# Altium schematic sheet frontend.SchDoc
size 297 x 209 mm
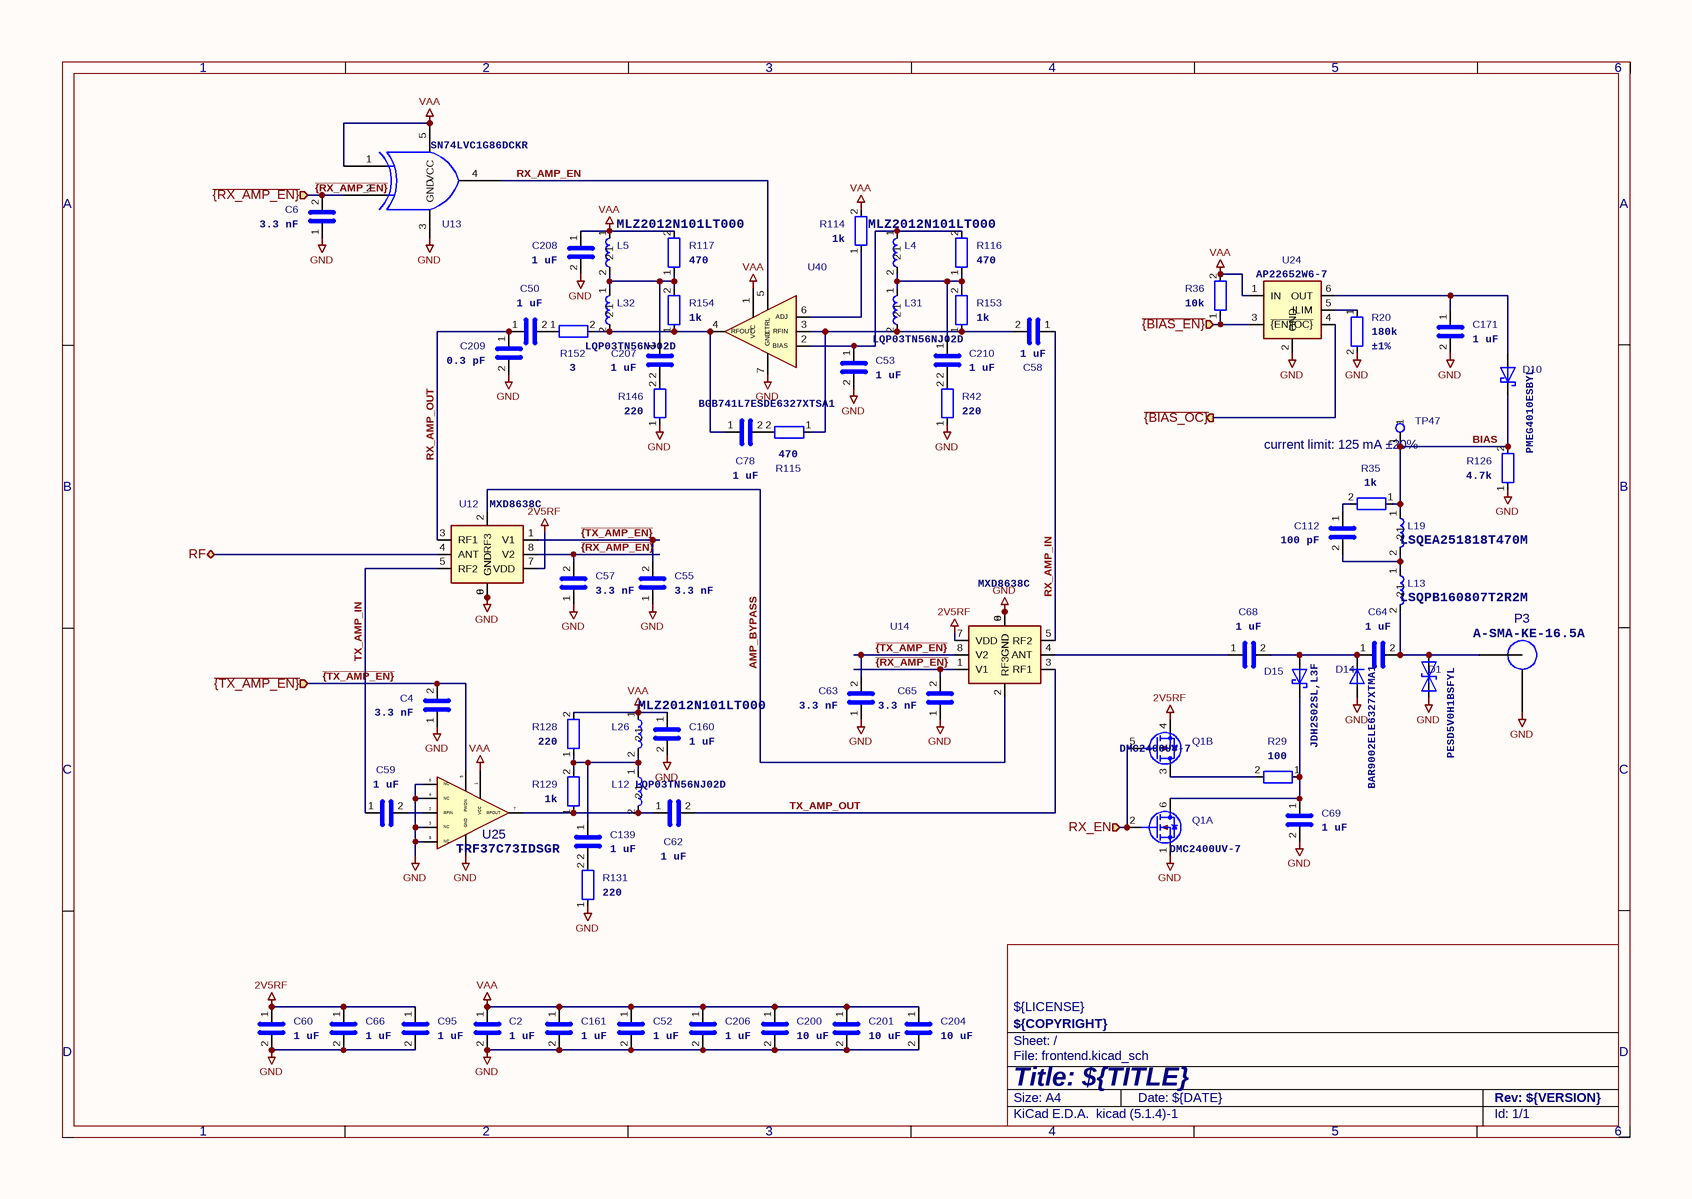
[diagram p0: frontend.SchDoc]

## Parts
C2  1 uF  [C_0201_0603Metric]
C4  3.3 nF  [C_0201_0603Metric]
C6  3.3 nF  [C_0201_0603Metric]
C50  1 uF  [C_0201_0603Metric]
C52  1 uF  [C_0201_0603Metric]
C53  1 uF  [C_0201_0603Metric]
C55  3.3 nF  [C_0201_0603Metric]
C57  3.3 nF  [C_0201_0603Metric]
C58  1 uF  [C_0201_0603Metric]
C59  1 uF  [C_0201_0603Metric]
C60  1 uF  [C_0201_0603Metric]
C62  1 uF  [C_0201_0603Metric]
C63  3.3 nF  [C_0201_0603Metric]
C64  1 uF  [C_0402_1005Metric]
C65  3.3 nF  [C_0201_0603Metric]
C66  1 uF  [C_0201_0603Metric]
C68  1 uF  [C_0201_0603Metric]
C69  1 uF  [C_0201_0603Metric]
C78  1 uF  [C_0201_0603Metric]
C95  1 uF  [C_0201_0603Metric]
C112  100 pF  [C_0201_0603Metric]
C139  1 uF  [C_0201_0603Metric]
C160  1 uF  [C_0201_0603Metric]
C161  1 uF  [C_0201_0603Metric]
C171  1 uF  [C_0402_1005Metric]
C200  10 uF  [C_0805_2012Metric]
C201  10 uF  [C_0805_2012Metric]
C204  10 uF  [C_0805_2012Metric]
C206  1 uF  [C_0201_0603Metric]
C207  1 uF  [C_0201_0603Metric]
C208  1 uF  [C_0201_0603Metric]
C209  0.3 pF  [C_0201_0603Metric]
C210  1 uF  [C_0201_0603Metric]
D1  Part Number: PESD5V0H1BSFYL  [TSSLP-2-1]  (hidden comment: TVS)
D10  Part Number: PMEG4010ESBYL  [TSLP-2-19]  (hidden comment: Schottky)
D14  Part Number: BAR9002ELE6327XTMA1  [TSLP-2-19]  (hidden comment: PIN)
D15  Part Number: JDH2S02SL,L3F  [TSSLP-2-1]  (hidden comment: Schottky)
L4  Part Number: MLZ2012N101LT000  [L_TDK_MLZ2012_h1.25mm]  (hidden comment: 100 uH)
L5  Part Number: MLZ2012N101LT000  [L_TDK_MLZ2012_h1.25mm]  (hidden comment: 100 uH)
L12  Part Number: LQP03TN56NJ02D  [L_0201_0603Metric]  (hidden comment: 56 nH)
L13  Part Number: LSQPB160807T2R2M  [L_0603_1608Metric]  (hidden comment: 2.2 uH)
L19  Part Number: LSQEA251818T470M  [L_Taiyo-Yuden_A251818]  (hidden comment: 47 uH)
L26  Part Number: MLZ2012N101LT000  [L_TDK_MLZ2012_h1.25mm]  (hidden comment: 100 uH)
L31  Part Number: LQP03TN56NJ02D  [L_0201_0603Metric]  (hidden comment: 56 nH)
L32  Part Number: LQP03TN56NJ02D  [L_0201_0603Metric]  (hidden comment: 56 nH)
P3  Part Number: A-SMA-KE-16.5A  [SMA_MyAntenna_A-SMA-KE-16.5A_EdgeMount]  (hidden comment: SMA)
Q1  Part Number: DMC2400UV-7  [SOT-563]  (hidden comment: NMOS/PMOS)  (parts A,B of 2)
R20  Tolerance: ±1%  [R_0402_1005Metric]  (hidden comment: 180k)
R29  100  [R_0201_0603Metric]
R35  1k  [R_0201_0603Metric]
R36  10k  [R_0402_1005Metric]
R42  220  [R_0201_0603Metric]
R114  1k  [R_0201_0603Metric]
R115  470  [R_0201_0603Metric]
R116  470  [R_0201_0603Metric]
R117  470  [R_0201_0603Metric]
R126  4.7k  [R_0201_0603Metric]
R128  220  [R_0201_0603Metric]
R129  1k  [R_0201_0603Metric]
R131  220  [R_0201_0603Metric]
R146  220  [R_0201_0603Metric]
R152  3  [R_0201_0603Metric]
R153  1k  [R_0201_0603Metric]
R154  1k  [R_0201_0603Metric]
TP47  TestPoint  [TestPoint_Pad_D1.0mm]  (value not drawn)
U12  MXD8638C  [MXD8638C]
U13  Part Number: SN74LVC1G86DCKR  [SOT-353_SC-70-5]  (hidden comment: 74LVC1G86)
U14  MXD8638C  [MXD8638C]
U24  Part Number: AP22652W6-7  [TSOP-6_1.65x3.05mm_P0.95mm]  (hidden comment: AP22652)
U25  Part Number: TRF37C73IDSGR  [WSON-8-1EP_2x2mm_P0.5mm_EP0.9x1.6mm]  (hidden comment: TRF37C73)
U40  Part Number: BGB741L7ESDE6327XTSA1  [TSLP-7-1]  (hidden comment: BGB741L7ESD)

## Ports
RF (bidir), RX_EN (in), ~{{BIAS_EN}} (in), ~{{BIAS_OC}} (out), ~{{RX_AMP_EN}} (in), ~{{TX_AMP_EN}} (in)

## Nets
2V5RF: C60.1 C66.1 C95.1 Q1.4(S) U12.7(VDD) U14.7(VDD)
GND: C2.2 C4.1 C6.1 C52.2 C53.2 C55.1 C57.1 C60.2 C63.1 C65.1 C66.2 C69.2 C95.2 C160.2 C161.2 C171.2 C200.2 C201.2 C204.2 C206.2 C208.2 C209.2 D1.2(A2) D14.2(A) P3.2(GND) Q1.1(S) R20.2 R42.1 R126.1 R131.1 R146.1 U12.6(GND) U12.9(GND) U13.3(GND) U14.6(GND) U14.9(GND) U24.2(GND) U25.3(NC) U25.4(NC) U25.6(NC) U25.8(NC) U25.9(GND) U40.7(GND)
VAA: C2.1 C52.1 C160.1 C161.1 C200.1 C201.1 C204.1 C206.1 C208.1 L5.1 L26.1 R36.2 R114.2 R117.2 R128.2 U13.1 U13.5(VCC) U24.1(IN) U25.1(VCC) U40.1(VCC)
AMP_BYPASS: U12.2(RF3) U14.2(RF3)
BIAS: D10.1(K) L19.1 R35.1 R126.2 TP47.1
RF: U12.4(ANT) ; port RF
RX_AMP_EN: U13.4 U40.5(CTRL)
RX_AMP_IN: C58.1 U14.5(RF2)
RX_AMP_OUT: C50.1 C209.1 U12.3(RF1)
RX_EN: Q1.2(G) Q1.5(G) ; port RX_EN
TX_AMP_IN: C59.1 U12.5(RF2)
TX_AMP_OUT: C62.2 U14.3(RF1)
~{{BIAS_EN}}: R36.1 U24.3(~{{EN}}) ; port ~{{BIAS_EN}}
~{{BIAS_OC}}: U24.4(~{{OC}}) ; port ~{{BIAS_OC}}
~{{RX_AMP_EN}}: C6.2 C57.2 C65.2 U12.8(V2) U13.2 U14.1(V1) ; port ~{{RX_AMP_EN}}
~{{TX_AMP_EN}}: C4.2 C55.2 C63.2 U12.1(V1) U14.8(V2) U25.5(PWDN) ; port ~{{TX_AMP_EN}}
NetC50_2: C50.2 R152.1
NetC53_1: C53.1 L4.1 R116.2 U40.2(BIAS)
NetC58_2: C58.2 L31.2 R115.1 R153.1 U40.3(RFIN)
NetC59_2: C59.2 U25.2(RFIN)
NetC62_1: C62.1 L12.2 R129.1 U25.7(RFOUT)
NetC64_1: C64.1 C68.2 D14.1(K) D15.2(A)
NetC64_2: C64.2 D1.1(A1) L13.2 P3.1(RF)
NetC68_1: C68.1 U14.4(ANT)
NetC69_1: C69.1 D15.1(K) Q1.6(D) R29.1
NetC78_1: C78.1 L32.2 R152.2 R154.1 U40.4(RFOUT)
NetC78_2: C78.2 R115.2
NetC112_1: C112.1 R35.2
NetC112_2: C112.2 L13.1 L19.2
NetC139_1: C139.1 L12.1 L26.2 R128.1 R129.2
NetC139_2: C139.2 R131.2
NetC171_1: C171.1 D10.2(A) U24.6(OUT)
NetC207_1: C207.1 L5.2 L32.1 R117.1 R154.2
NetC207_2: C207.2 R146.2
NetC210_1: C210.1 L4.2 L31.1 R116.1 R153.2
NetC210_2: C210.2 R42.2
NetQ1_3: Q1.3(D) R29.2
NetR20_1: R20.1 U24.5(ILIM)
NetR114_1: R114.1 U40.6(ADJ)

## Notes on the sheet
- (near TP47) current limit: 125 mA ±20%
- 1
- 2
- 3
- 4
- 5
- 6
- A
- B
- C
- ${LICENSE}
- D
- Title: ${TITLE}
- File: frontend.kicad_sch
- Sheet: /
- ${COPYRIGHT}
- KiCad E.D.A.  kicad (5.1.4)-1
- Size: A4
- Date: ${DATE}
- Rev: ${VERSION}
- Id: 1/1

## Library data of the parts
C2 C50 C52 C53 C58-C60 C62 C66 C68 C69 C78 C95 C139 C160 C161 C206-C208 C210 = C: Manufacturer: Murata; Part Number: GRM033R61A105ME44D; Substitution: GRM033R61A105ME44*, GRM033R61C105ME15*, Samsung CL03A105MO3NRN*; Value: 1 uF; Footprint: Capacitor_SMD:C_0201_0603Metric
C4 C6 C55 C57 C63 C65 = C: Manufacturer: Murata; Part Number: GRM033R71A332KA01D; Substitution: GRM033R71A332K*; Value: 3.3 nF; Footprint: Capacitor_SMD:C_0201_0603Metric
C64 C171 = C: Manufacturer: Samsung; Part Number: CL05A105KA5NQNC; Substitution: Murata GRM155R61E105KA12D; Value: 1 uF; Footprint: Capacitor_SMD:C_0402_1005Metric
C112 = C: Manufacturer: Murata; Part Number: GRM0335C1E101JA01D; Substitution: GRM0335C1E101JA01*, GRM0335C1H101JA01*; Value: 100 pF; Footprint: Capacitor_SMD:C_0201_0603Metric
C200 C201 C204 = C: Manufacturer: Samsung; Part Number: CL21A106KOQNNNE; Substitution: Murata GRM21BR61A106KE19L; Value: 10 uF; Footprint: Capacitor_SMD:C_0805_2012Metric
C209 = C: Manufacturer: Murata; Part Number: GRM0335C1ER30BA01D; Substitution: GRM0335C1*R30*A01*, GRM0335C2*R30*A01*; Value: 0.3 pF; Footprint: Capacitor_SMD:C_0201_0603Metric
D1 = D_TVS: Manufacturer: Nexperia; Substitution: PESD5V0H1BSF; Value: TVS; Footprint: praline:TSSLP-2-1
D10 = D_Schottky: Manufacturer: Nexperia; Value: Schottky; Footprint: praline:TSLP-2-19
D14 = D: Manufacturer: Infineon; Value: PIN; Footprint: praline:TSLP-2-19
D15 = D_Schottky: Manufacturer: Toshiba; Value: Schottky; Footprint: praline:TSSLP-2-1
L4 L5 L26 = L: Manufacturer: TDK; Substitution: MLZ2012N101LTD25; Value: 100 uH; Footprint: praline:L_TDK_MLZ2012_h1.25mm
L12 L31 L32 = L: Manufacturer: Murata; Substitution: LQP03TN56NH02D; Value: 56 nH; Footprint: Inductor_SMD:L_0201_0603Metric
L13 = L: Manufacturer: Taiyo Yuden; Substitution: BRL1608T2R2M, LLQPB160807T2R2M; Value: 2.2 uH; Footprint: Inductor_SMD:L_0603_1608Metric
L19 = L: Manufacturer: Taiyo Yuden; Substitution: LSQEA251818T470K, LBR2518T470M, LBR2518T470K; Value: 47 uH; Footprint: praline:L_Taiyo-Yuden_A251818
P3 = GSG-RF-CONN: Manufacturer: MyAntenna; Substitution: M04-0102170R0A; Value: SMA; Footprint: praline:SMA_MyAntenna_A-SMA-KE-16.5A_EdgeMount
Q1 = Q_Dual_NMOS_PMOS_S1G1D2S2G2D1: Manufacturer: Diodes Inc.; Substitution: DMC2400UV*; Value: NMOS/PMOS; Footprint: Package_TO_SOT_SMD:SOT-563
R20 = R: Manufacturer: Yageo; Part Number: RC0402FR-07180KL; Substitution: any equivalent; Value: 180k; Footprint: Resistor_SMD:R_0402_1005Metric
R29 = R: Manufacturer: Yageo; Part Number: RC0201JR-07100RL; Substitution: any equivalent; Value: 100; Footprint: Resistor_SMD:R_0201_0603Metric
R35 R114 R129 R153 R154 = R: Manufacturer: Yageo; Part Number: RC0201FR-071KL; Substitution: any equivalent; Value: 1k; Footprint: Resistor_SMD:R_0201_0603Metric
R36 = R: Manufacturer: Yageo; Part Number: RC0402JR-0710KL; Substitution: any equivalent; Value: 10k; Footprint: Resistor_SMD:R_0402_1005Metric
R42 R128 R131 R146 = R: Manufacturer: Yageo; Part Number: RC0201JR-07220RL; Substitution: any equivalent; Value: 220; Footprint: Resistor_SMD:R_0201_0603Metric
R115-R117 = R: Manufacturer: Yageo; Part Number: RC0201JR-07470RL; Substitution: any equivalent; Value: 470; Footprint: Resistor_SMD:R_0201_0603Metric
R126 = R: Manufacturer: Yageo; Part Number: RC0201FR-074K7L; Substitution: any equivalent; Value: 4.7k; Footprint: Resistor_SMD:R_0201_0603Metric
R152 = R: Manufacturer: Yageo; Part Number: RC0201JR-073RL; Substitution: any equivalent; Value: 3; Footprint: Resistor_SMD:R_0201_0603Metric
U12 U14 = MXD8638: Manufacturer: Maxscend; Part Number: MXD8638C; Value: MXD8638C; Footprint: praline:MXD8638C
U13 = 74LVC1G86: Manufacturer: UMW; Substitution: TI SN74LVC1G86DCKR; Value: 74LVC1G86; Footprint: Package_TO_SOT_SMD:SOT-353_SC-70-5
U24 = BD2243G: Manufacturer: Diodes Inc.; Value: AP22652; Footprint: Package_SO:TSOP-6_1.65x3.05mm_P0.95mm
U25 = TRF37A73: Manufacturer: Texas Instruments; Substitution: TRF37C73*; Value: TRF37C73; Footprint: Package_SON:WSON-8-1EP_2x2mm_P0.5mm_EP0.9x1.6mm
U40 = BGB741L7ESD: Manufacturer: Infineon; Value: BGB741L7ESD; Footprint: praline:TSLP-7-1
TP47 = TestPoint: Value: TestPoint; Footprint: TestPoint:TestPoint_Pad_D1.0mm